# Altium project Control_Board_Model_C201.PrjPcb (part 7 of 8)

## Sheet BG95_Misc.SchDoc: BG95_Misc
size A4; DocumentNumber: 18; SheetNumber: 18; SheetTotal: 50
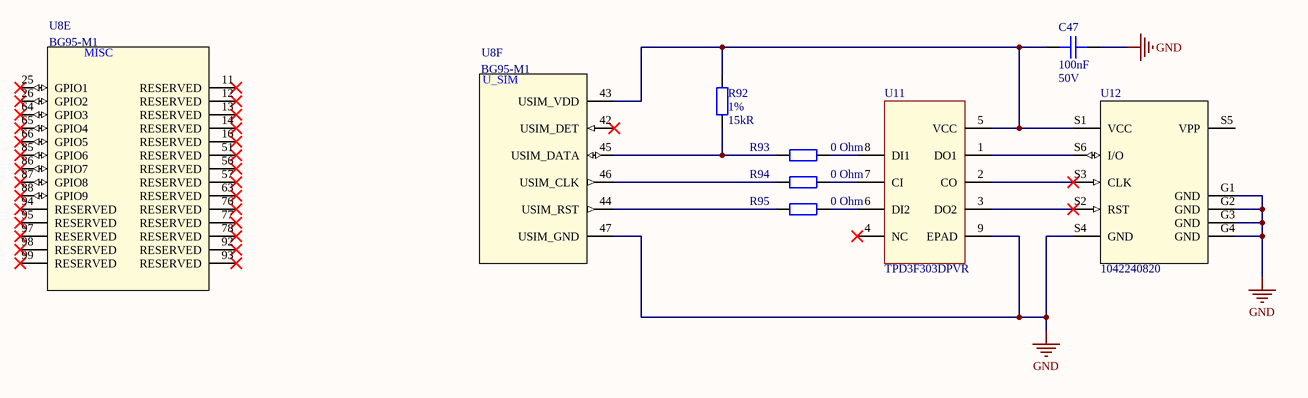
[diagram p14: BG95_Misc.SchDoc]

### Parts
C47  Capacitance: 100nF  Voltage: 50V  [C0402]  (hidden comment: CAP CER 0.1UF 50V X7R 0402)
R92  Tolerance: 1%  Resistance: 15kR  [R0402]  (hidden comment: RES SMD 15K OHM 1% 1/16W 0402)
R93  Resistance: 0 Ohm  [R0402]  (hidden comment: RES SMD 0 OHM JUMPER 1/16W 0402)
R94  Resistance: 0 Ohm  [R0402]  (hidden comment: RES SMD 0 OHM JUMPER 1/16W 0402)
R95  Resistance: 0 Ohm  [R0402]  (hidden comment: RES SMD 0 OHM JUMPER 1/16W 0402)
U8  BG95-M1  [BG95]  (parts E,F of 6)
U11  TPD3F303DPVR  [DPV8_1P7X0P4]
U12  1042240820  [1042240820_MOL]

### Nets
GND: C47.2 U8.47(USIM_GND) U11.9(EPAD) U12.G1(GND) U12.G2(GND) U12.G3(GND) U12.G4(GND) U12.S4(GND)
NetC47_1: C47.1 R92.2 U8.43(USIM_VDD) U11.5(VCC) U12.S1(VCC)
NetR92_1: R92.1 R93.1 U8.45(USIM_DATA)
NetR93_2: R93.2 U11.8(DI1)
NetR94_1: R94.1 U8.46(USIM_CLK)
NetR94_2: R94.2 U11.7(CI)
NetR95_1: R95.1 U8.44(USIM_RST)
NetR95_2: R95.2 U11.6(DI2)
NetU11_1: U11.1(DO1) U12.S6(I/O)
NetU11_2: U11.2(CO) U12.S3(CLK)
NetU11_3: U11.3(DO2) U12.S2(RST)

Not connected (* = marked no-connect by the designer): U8 11(RESERVED)* 12(RESERVED)* 13(RESERVED)* 14(RESERVED)* 16(RESERVED)* 25(GPIO1)* 26(GPIO2)* 42(USIM_DET)* 51(RESERVED)* 56(RESERVED)* 57(RESERVED)* 63(RESERVED)* 64(GPIO3)* 65(GPIO4)* 66(GPIO5)* 76(RESERVED)* 77(RESERVED)* 78(RESERVED)* 85(GPIO6)* 86(GPIO7)* 87(GPIO8)* 88(GPIO9)* 92(RESERVED)* 93(RESERVED)* 94(RESERVED)* 95(RESERVED)* 97(RESERVED)* 98(RESERVED)* 99(RESERVED)*; U11 4(NC)*; U12 S5(VPP)

### Notes on the sheet
- Title
- Size:
- Date:
- A4
- Number:
- Time:
- Revision:
- Sheet
- of
- File:
- (in symbol MOD BG95 RX TXRX CELLULAR LTE/NAV SMD, part E) MISC
- (in symbol MOD BG95 RX TXRX CELLULAR LTE/NAV SMD, part F) U_SIM

### Library data of the parts
C47 = CAP CER 0.1UF 50V X7R 0402: as C30 on sheet User_Interface; Supplier 1: Digi-Key; Stock 1: 2925303; Pricing 1: 1=0.17, 10=0.118, 50=0.0668, 100=0.0553, 500=0.0388, 1000=0.0321, 2500=0.0299, 5000=0.0273 (USD); Mount: Surface Mount; Case/Package: 0402; Weight: 2.3E-05oz; Case Code (Metric): 1005; Case Code (Imperial): 0402; Min Operating Temperature: -55°C; Max Operating Temperature: 125°C; Voltage Rating: 50V; Tolerance: 10%; Packaging: Tape and Reel; Package Quantity: 1; Voltage Rating (DC): 50V; Dielectric: X7R; Termination: SMD/SMT; Composition: Ceramic; Length: 1mm; Height: 0.5mm; Width: 0.02inch; Thickness: 0.022inch; Depth: 0.5mm; Ratings: AEC-Q200; REACH SVHC: No SVHC; Lead Free: Lead Free; ComponentLink1URL: http://product.tdk.com/capacitor/mlcc/en/documents/mlccspec_automotive_general_midvoltage_en.pdf?src-supplier=Future+Electronics; ComponentLink1Description: http://product.tdk.com/capacitor/mlcc/en/documents/mlccspec_automotive_general_midvoltage_en.pdf?src-supplier=Future+Electronics; ComponentLink2URL: http://www.farnell.com/datasheets/1807242.pdf?src-supplier=Element14; ComponentLink2Description: http://www.farnell.com/datasheets/1807242.pdf?src-supplier=Element14; ComponentLink3URL: http://www.mouser.com/ds/2/400/lcc_automotive_general_en-843974.pdf?src-supplier=Mouser; ComponentLink3Description: http://www.mouser.com/ds/2/400/lcc_automotive_general_en-843974.pdf?src-supplier=Mouser; ComponentLink4URL: http://www.farnell.com/datasheets/1936565.pdf?src-supplier=Element14; ComponentLink4Description: http://www.farnell.com/datasheets/1936565.pdf?src-supplier=Element14; ComponentLink5URL: http://www.farnell.com/datasheets/1735392.pdf?src-supplier=Element14; ComponentLink5Description: http://www.farnell.com/datasheets/1735392.pdf?src-supplier=Element14; Supplier Part Number 1: 445-6899-1-ND; ClassName: P109
R92 = RES SMD 15K OHM 1% 1/16W 0402: 15 kOhms ±1% 0.063W, 1/16W Chip Resistor 0402 (1005 Metric)  Thick Film; Manufacturer: Yageo; Manufacturer Part Number: RC0402FR-0715KL; Power Rating: 62.5mW; Voltage Rating: 50V; Temperature Coefficient: 100ppm/°C; Max Power Dissipation: 63mW; Supplier 1: Digi-Key; Stock 1: 5005874; Pricing 1: 1=0.1, 10=0.014, 100=0.0058, 1000=0.0026, 2500=0.0023, 5000=0.0019 (USD); Case/Package: 0402; Number of Pins: 2; Weight: 2.3E-05oz; Case Code (Imperial): 0402; Case Code (Metric): 1005; Min Operating Temperature: -55°C; Max Operating Temperature: 155°C; Packaging: Tape and Reel; Package Quantity: 1; Termination: SMD/SMT; Resistor Type: Thick Film; Number of Terminations: 2; Features: Moisture Resistant; Voltage Rating (DC): 50V; Length: 1mm; Height: 0.016inch; Width: 0.5mm; Depth: 0.5mm; REACH SVHC: No SVHC; Military Standard: Not; Lead Free: Lead Free; ComponentLink1URL: http://www.farnell.com/datasheets/2167052.pdf?src-supplier=Element14; ComponentLink1Description: http://www.farnell.com/datasheets/2167052.pdf?src-supplier=Element14; ComponentLink2URL: http://www.mouser.com/ds/2/447/PYu-RC0402_51_RoHS_L_6_r-8721.pdf?src-supplier=Mouser; ComponentLink2Description: http://www.mouser.com/ds/2/447/PYu-RC0402_51_RoHS_L_6_r-8721.pdf?src-supplier=Mouser; ComponentLink3URL: http://www.yageo.com/documents/recent/PYu-RC_Group_51_RoHS_L_10.pdf?src-supplier=Digi-Key; ComponentLink3Description: http://www.yageo.com/documents/recent/PYu-RC_Group_51_RoHS_L_10.pdf?src-supplier=Digi-Key; ComponentLink4URL: http://www.yageo.com/documents/recent/PYu-RC0402_51_RoHS_L_6_r.pdf?src-supplier=Future+Electronics; ComponentLink4Description: http://www.yageo.com/documents/recent/PYu-RC0402_51_RoHS_L_6_r.pdf?src-supplier=Future+Electronics; Supplier Part Number 1: 311-15.0KLRCT-ND; ClassName: P109; Mount: Surface Mount
R93-R95 = RES SMD 0 OHM JUMPER 1/16W 0402: 0 Ohms Jumper 0.063W, 1/16W Chip Resistor 0402 (1005 Metric) Moisture Resistant Thick Film; Manufacturer: Yageo; Manufacturer Part Number: RC0402JR-070RL; Power Rating: 62.5mW; Voltage Rating: 50V; Max Power Dissipation: 63mW; Temperature Coefficient: 200ppm/°C; Tolerance: 5%; Supplier 1: Digi-Key; Stock 1: 46057148; Pricing 1: 1=0.1, 10=0.013, 25=0.0092, 50=0.0072, 100=0.0053, 250=0.004, 500=0.0032, 1000=0.0024, 5000=0.0017 (USD); Contact Plating: Tin,Matte; Case Code (Metric): 1005; Case Code (Imperial): 0402; Min Operating Temperature: -55°C; Max Operating Temperature: 155°C; Packaging: Tape and Reel; Composition: Thick Film; Package Quantity: 1; Number of Terminations: 2; Termination: SMD/SMT; Military Standard: Not; Features: Moisture Resistant; Length: 1mm; Height: 0.016inch; Width: 0.02inch; Depth: 0.5mm; Radiation Hardening: No; REACH SVHC: Unknown; Lead Free: Lead Free; ComponentLink1URL: http://www.yageo.com/documents/recent/PYu-RC_Group_51_RoHS_L_10.pdf?src-supplier=Digi-Key; ComponentLink1Description: http://www.yageo.com/documents/recent/PYu-RC_Group_51_RoHS_L_10.pdf?src-supplier=Digi-Key; ComponentLink2URL: http://www.yageo.com/documents/recent/PYu-RC0402_51_RoHS_L_6.pdf?src-supplier=Avnet+Europe; ComponentLink2Description: http://www.yageo.com/documents/recent/PYu-RC0402_51_RoHS_L_6.pdf?src-supplier=Avnet+Europe; ComponentLink3URL: http://www.farnell.com/datasheets/1018594.pdf?src-supplier=Element14; ComponentLink3Description: http://www.farnell.com/datasheets/1018594.pdf?src-supplier=Element14; ComponentLink4URL: https://www.verical.com/server-webapp/html/getDatasheet?partID=326379&src-supplier=Verical; ComponentLink4Description: https://www.verical.com/server-webapp/html/getDatasheet?partID=326379&src-supplier=Verical; ComponentLink5URL: http://www.farnell.com/datasheets/2167052.pdf?src-supplier=Element14; ComponentLink5Description: http://www.farnell.com/datasheets/2167052.pdf?src-supplier=Element14; Supplier Part Number 1: 311-0.0JRCT-ND; Case/Package: 0402; ClassName: P109; Mount: Surface Mount
U8 = MOD BG95 RX TXRX CELLULAR LTE/NAV SMD: as U8 on sheet BG95_Broadband_Modem; Manufacturer Part Number: BG95-M1; PCB DECAL: BG95; Mount: Surface Mount
U11 = FILTER RC(PI) ESD SMD  8-UFDFN EP: RC (Pi) EMI Filter 2nd Order Low Pass 3 Channel R = 47Ohms, 100Ohms, C = 20pF  8-UFDFN Exposed Pad; Manufacturer: Texas Instruments; Number of Channels: 3; Operating Supply Voltage: 5.5V; Clamping Voltage: 10V; ESD Protection: Yes; Frequency: 308MHz; Supplier 1: Digi-Key; Manufacturer Part Number: TPD3F303DPVR; Stock 1: 4896; Pricing 1: 1=0.85, 10=0.812, 25=0.7856, 50=0.6414, 100=0.576, 250=0.5236, 500=0.4974, 1000=0.4451 (USD); Number of Pins: 8; Min Operating Temperature: -40°C; Max Operating Temperature: 85°C; Package Quantity: 1; Packaging: Tape and Reel; Termination: Flat; REACH SVHC: No SVHC; Lead Free: Lead Free; ComponentLink1URL: http://www.ti.com/lit/ds/symlink/tpd3f303.pdf?src-supplier=Digi-Key; ComponentLink1Description: http://www.ti.com/lit/ds/symlink/tpd3f303.pdf?src-supplier=Digi-Key; ComponentLink2URL: http://focus.ti.com/lit/ds/symlink/tpd3f303.pdf?src-supplier=Avnet+Europe; ComponentLink2Description: http://focus.ti.com/lit/ds/symlink/tpd3f303.pdf?src-supplier=Avnet+Europe; ComponentLink3URL: https://www.verical.com/server-webapp/html/getDatasheet?partID=302817&src-supplier=Verical; ComponentLink3Description: https://www.verical.com/server-webapp/html/getDatasheet?partID=302817&src-supplier=Verical; ComponentLink4URL: http://www.farnell.com/datasheets/1558442.pdf?src-supplier=Element14; ComponentLink4Description: http://www.farnell.com/datasheets/1558442.pdf?src-supplier=Element14; Supplier Part Number 1: 296-28299-1-ND; Case/Package: SMD/SMT; Contact Plating: Gold; Capacitance: 20pF; Length: 2.2mm; Height: 0.026inch; Width: 0.063inch; Depth: 1.7mm; Radiation Hardening: No; ClassName: P109; Mount: Surface Mount
U12 = NANOSIM SOCKET 1.11H P/PULL TYPE: 6 Position Card Connector NANO SIM Surface Mount, Right Angle Gold; Manufacturer: Molex; Number of Positions: 6; Pitch: 2.54mm; Supplier 1: Digi-Key; Manufacturer Part Number: 1042240820; Stock 1: 10989; Pricing 1: 1=1.31, 10=1.152, 25=1.0844, 50=1.039, 100=0.9939, 250=0.9036, 500=0.8132, 1000=0.7228 (USD); Mount: Surface Mount; Contact Plating: Gold; Number of Rows: 2; Orientation: Right Angle; Connector Type: Connector; Packaging: Tape and Reel; ComponentLink1URL: https://www.molex.com/pdm_docs/sd/1042240820_sd.pdf?src-supplier=Digi-Key; ComponentLink1Description: https://www.molex.com/pdm_docs/sd/1042240820_sd.pdf?src-supplier=Digi-Key; ComponentLink2URL: http://www.molex.com/pdm_docs/sd/1042240820_sd.pdf?src-supplier=Avnet; ComponentLink2Description: http://www.molex.com/pdm_docs/sd/1042240820_sd.pdf?src-supplier=Avnet; Supplier Part Number 1: WM23749CT-ND; ClassName: P109

## Sheet BG95_Power.SchDoc: BG95 Power Domain
size A4; DocumentNumber: 17; SheetNumber: 17; SheetTotal: 50
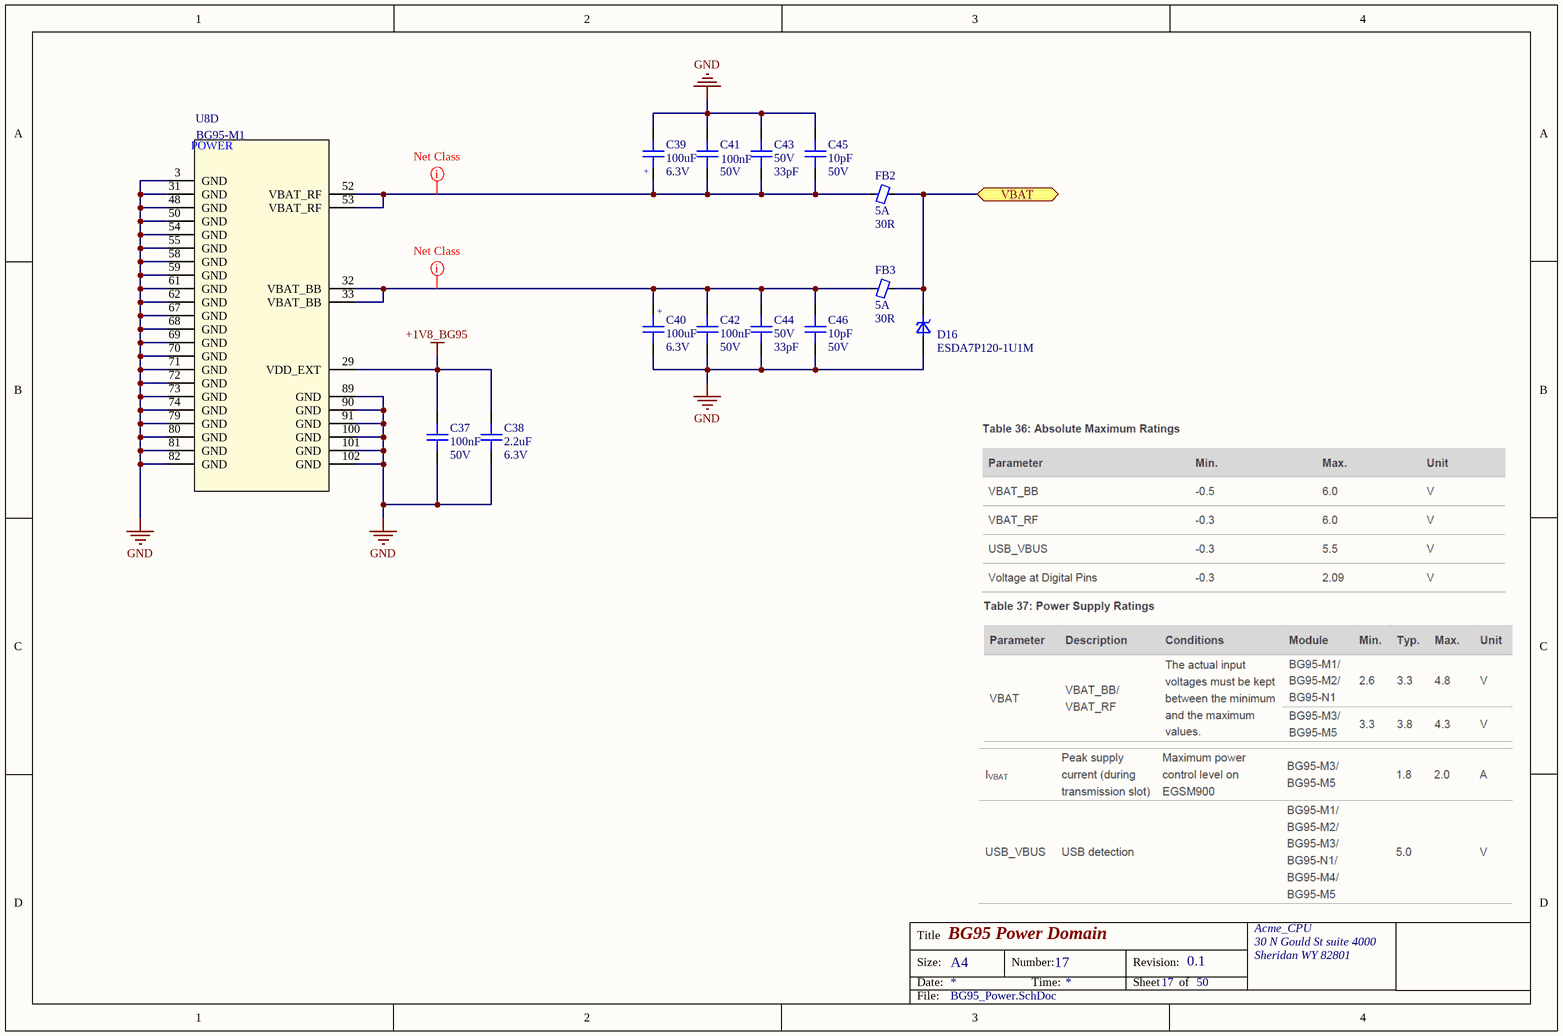
[diagram p15: BG95_Power.SchDoc]

### Parts
C37  Capacitance: 100nF  Voltage: 50V  [C0402]  (hidden comment: CAP CER 0.1UF 50V X7R 0402)
C38  Capacitance: 2.2uF  Voltage: 6.3V  [C0402]  (hidden comment: CAP CER 2.2UF 6.3V X5R 0402)
C39  Capacitance: 100uF  Voltage Rating: 6.3V  [WCAP-ASLI_5x5.5]  (hidden comment: CAP ALUM 100 UF 20% 6.3 V SMD)
C40  Capacitance: 100uF  Voltage Rating: 6.3V  [WCAP-ASLI_5x5.5]  (hidden comment: CAP ALUM 100 UF 20% 6.3 V SMD)
C41  Capacitance: 100nF  Voltage: 50V  [C0402]  (hidden comment: CAP CER 0.1UF 50V X7R 0402)
C42  Capacitance: 100nF  Voltage: 50V  [C0402]  (hidden comment: CAP CER 0.1UF 50V X7R 0402)
C43  Voltage Rating: 50V  Capacitance: 33pF  [C0402]  (hidden comment: CAP CER 33PF 50V C0G/NPO 0402)
C44  Voltage Rating: 50V  Capacitance: 33pF  [C0402]  (hidden comment: CAP CER 33PF 50V C0G/NPO 0402)
C45  Capacitance: 10pF  Voltage Rating: 50V  [C0402]  (hidden comment: CAP CER 10PF 50V C0G/NP0 0402)
C46  Capacitance: 10pF  Voltage Rating: 50V  [C0402]  (hidden comment: CAP CER 10PF 50V C0G/NP0 0402)
D16  ESDA7P120-1U1M  [ST_QFN_1610]
FB2  Current Rating: 5A  Impedance: 30R  [L0603]  (hidden comment: MPZ1608S300ATAH0)
FB3  Current Rating: 5A  Impedance: 30R  [L0603]  (hidden comment: MPZ1608S300ATAH0)
U8  BG95-M1  [BG95]  (part D of 6)

### Ports
VBAT

### Nets
+1V8_BG95: C37.2 C38.2 U8.29(VDD_EXT)
GND: C37.1 C38.1 C39.2 C40.2 C41.2 C42.1 C43.2 C44.1 C45.2 C46.1 D16.2(A) U8.3(GND) U8.31(GND) U8.48(GND) U8.50(GND) U8.54(GND) U8.55(GND) U8.58(GND) U8.59(GND) U8.61(GND) U8.62(GND) U8.67(GND) U8.68(GND) U8.69(GND) U8.70(GND) U8.71(GND) U8.72(GND) U8.73(GND) U8.74(GND) U8.79(GND) U8.80(GND) U8.81(GND) U8.82(GND) U8.89(GND) U8.90(GND) U8.91(GND) U8.100(GND) U8.101(GND) U8.102(GND)
NetC39_1: C39.1 C41.1 C43.1 C45.1 FB2.1 U8.52(VBAT_RF) U8.53(VBAT_RF)
NetC40_1: C40.1 C42.2 C44.2 C46.2 FB3.1 U8.32(VBAT_BB) U8.33(VBAT_BB)
NetD16_1: D16.1(K) FB2.2 FB3.2 ; port VBAT

### Layout directives
net class BG95_PWR: NetC39_1, NetC40_1

### Notes on the sheet
- Title
- Size:
- Date:
- A4
- Number:
- Time:
- Revision:
- Sheet
- of
- File:
- (in symbol CAP ALUM 100 UF 20% 6.3 V SMD) +
- (in symbol MOD BG95 RX TXRX CELLULAR LTE/NAV SMD, part D) POWER

### Library data of the parts
C37 C41 C42 = CAP CER 0.1UF 50V X7R 0402: as C30 on sheet User_Interface; Supplier 1: Digi-Key; Stock 1: 2925303; Pricing 1: 1=0.17, 10=0.118, 50=0.0668, 100=0.0553, 500=0.0388, 1000=0.0321, 2500=0.0299, 5000=0.0273 (USD); Mount: Surface Mount; Case/Package: 0402; Weight: 2.3E-05oz; Case Code (Metric): 1005; Case Code (Imperial): 0402; Min Operating Temperature: -55°C; Max Operating Temperature: 125°C; Voltage Rating: 50V; Tolerance: 10%; Packaging: Tape and Reel; Package Quantity: 1; Voltage Rating (DC): 50V; Dielectric: X7R; Termination: SMD/SMT; Composition: Ceramic; Length: 1mm; Height: 0.5mm; Width: 0.02inch; Thickness: 0.022inch; Depth: 0.5mm; Ratings: AEC-Q200; REACH SVHC: No SVHC; Lead Free: Lead Free; ComponentLink1URL: http://product.tdk.com/capacitor/mlcc/en/documents/mlccspec_automotive_general_midvoltage_en.pdf?src-supplier=Future+Electronics; ComponentLink1Description: http://product.tdk.com/capacitor/mlcc/en/documents/mlccspec_automotive_general_midvoltage_en.pdf?src-supplier=Future+Electronics; ComponentLink2URL: http://www.farnell.com/datasheets/1807242.pdf?src-supplier=Element14; ComponentLink2Description: http://www.farnell.com/datasheets/1807242.pdf?src-supplier=Element14; ComponentLink3URL: http://www.mouser.com/ds/2/400/lcc_automotive_general_en-843974.pdf?src-supplier=Mouser; ComponentLink3Description: http://www.mouser.com/ds/2/400/lcc_automotive_general_en-843974.pdf?src-supplier=Mouser; ComponentLink4URL: http://www.farnell.com/datasheets/1936565.pdf?src-supplier=Element14; ComponentLink4Description: http://www.farnell.com/datasheets/1936565.pdf?src-supplier=Element14; ComponentLink5URL: http://www.farnell.com/datasheets/1735392.pdf?src-supplier=Element14; ComponentLink5Description: http://www.farnell.com/datasheets/1735392.pdf?src-supplier=Element14; Supplier Part Number 1: 445-6899-1-ND; ClassName: P109
C38 = CAP CER 2.2UF 6.3V X5R 0402: 2.2µF ±20% 6.3V Ceramic Capacitor X5R 0402 (1005 Metric); Manufacturer: Murata; Manufacturer Part Number: GRM155R60J225ME15D; Supplier 1: Digi-Key; Stock 1: 4444410; Pricing 1: 1=0.29, 10=0.199, 100=0.1009, 500=0.0691, 1000=0.0611, 2500=0.0584, 5000=0.0531 (USD); Mount: Surface Mount; Case/Package: 0402; Case Code (Metric): 1005; Case Code (Imperial): 0402; Min Operating Temperature: -55°C; Max Operating Temperature: 85°C; Voltage Rating: 6.3V; Tolerance: 20%; Packaging: Tape and Reel; Package Quantity: 10000; Voltage Rating (DC): 6.3V; Dielectric: X5R; Termination: SMD/SMT; Length: 1mm; Height: 0.5mm; Width: 0.02inch; Thickness: 0.022inch; Depth: 0.5mm; REACH SVHC: No SVHC; Lead Free: Lead Free; ComponentLink1URL: https://www.murata.com/~/media/webrenewal/support/library/catalog/products/capacitor/mlcc/c02e.ashx?la=en-us&src-supplier=Digi-Key; ComponentLink1Description: https://www.murata.com/~/media/webrenewal/support/library/catalog/products/capacitor/mlcc/c02e.ashx?la=en-us&src-supplier=Digi-Key; ComponentLink2URL: http://www.murata.com/~/media/webrenewal/support/library/catalog/products/capacitor/mlcc/c02e.ashx?src-supplier=Avnet; ComponentLink2Description: http://www.murata.com/~/media/webrenewal/support/library/catalog/products/capacitor/mlcc/c02e.ashx?src-supplier=Avnet; ComponentLink3URL: http://www.farnell.com/datasheets/2047859.pdf?src-supplier=Element14; ComponentLink3Description: http://www.farnell.com/datasheets/2047859.pdf?src-supplier=Element14; ComponentLink4URL: https://produktinfo.conrad.com/datenblaetter/450000-474999/450128-da-01-de-VS_KONDENS_GRM155_R60J_225ME15D.pdf?src-supplier=Conrad; ComponentLink4Description: https://produktinfo.conrad.com/datenblaetter/450000-474999/450128-da-01-de-VS_KONDENS_GRM155_R60J_225ME15D.pdf?src-supplier=Conrad; Supplier Part Number 1: 490-4519-1-ND; Material: Ceramic; Radiation Hardening: No; ClassName: P109
C39 C40 = CAP ALUM 100 UF 20% 6.3 V SMD: 100µF 6.3V Aluminum Electrolytic Capacitors Radial, Can - SMD  2000 Hrs @ 105°C; Manufacturer: Wurth Elektronik; Manufacturer Part Number: 865080142007; Ripple Current: 170mA; Life (Hours): 2000Hour; Leakage Current: 6.3uA; Dissipation Factor: 24%; Endurance: 2000h; Capacitance Tolerance: +/-20%; Technical Reference: ASEC055101M6R3DVCTBB000; Polarity: Polar; Impedance: 800mR; Supplier 1: Digi-Key; Stock 1: 2227; Pricing 1: 1=0.2, 50=0.167, 100=0.145, 250=0.129, 500=0.113 (USD); Mount: Surface Mount; Case/Package: Radial; Min Operating Temperature: -55°C; Max Operating Temperature: 105°C; Package Quantity: 1000; Packaging: Tape and Reel; Tolerance: 20%; Height - Seated (Max): 0.217inch; ComponentLink1URL: http://www.we-online.de; ComponentLink1Description: Manufacturer; Supplier Part Number 1: 732-8472-1-ND; Ripple Current (AC): 170mA; Voltage Rating (DC): 6.3V; Diameter: 5mm; Height: 5.5mm; REACH SVHC: Unknown; ComponentLink2URL: https://www.we-online.com/catalog/datasheet/865080142007.pdf; ComponentLink2Description: Datasheet; Mounting Technology: SMT; Operating Temperature: -55 to +105degC; Published Date: May 2020; ComponentLink3URL: http://www.farnell.com/datasheets/1880090.pdf?src-supplier=Farnell; ComponentLink3Description: http://www.farnell.com/datasheets/1880090.pdf?src-supplier=Farnell; ComponentLink4URL: http://www.farnell.com/datasheets/1880090.pdf?src-supplier=Newark; ComponentLink4Description: http://www.farnell.com/datasheets/1880090.pdf?src-supplier=Newark; ComponentLink5URL: http://katalog.we-online.de/pbs/datasheet/865080142007.pdf?src-supplier=Digi-Key; ComponentLink5Description: http://katalog.we-online.de/pbs/datasheet/865080142007.pdf?src-supplier=Digi-Key; ComponentLink6URL: http://www.farnell.com/datasheets/1880090.pdf?src-supplier=Element14; ComponentLink6Description: http://www.farnell.com/datasheets/1880090.pdf?src-supplier=Element14; ComponentLink7URL: https://katalog.we-online.de/pbs/datasheet/865080142007.pdf?src-supplier=Digi-Key; ComponentLink7Description: https://katalog.we-online.de/pbs/datasheet/865080142007.pdf?src-supplier=Digi-Key; ClassName: P109
C43 C44 = CAP CER 33PF 50V C0G/NPO 0402: 33pF ±5% 50V Ceramic Capacitor C0G, NP0 0402 (1005 Metric); Manufacturer: Yageo; Manufacturer Part Number: CC0402JRNPO9BN330; Insulation Resistance: 100GR; Supplier 1: Digi-Key; Stock 1: 622219; Pricing 1: 1=0.1, 10=0.022, 100=0.0099, 500=0.0071, 1000=0.0056, 2500=0.0051, 5000=0.0047 (USD); Mount: Surface Mount; Number of Pins: 2; Weight: 2.3E-05oz; Case Code (Imperial): 0402; Case Code (Metric): 1005; Dielectric Material: Ceramic; Min Operating Temperature: -55°C; Max Operating Temperature: 125°C; Tolerance: 5%; Dielectric: C0G; Voltage Rating (DC): 50V; Packaging: Tape and Reel; Package Quantity: 1; Termination: SMD/SMT; Composition: Ceramic; Length: 1mm; Height: 0.5mm; Depth: 0.5mm; Width: 0.5mm; Thickness: 0.022inch; Radiation Hardening: No; REACH SVHC: No SVHC; Lead Free: Lead Free; ComponentLink1URL: https://www.verical.com/server-webapp/html/getDatasheet?partID=403453&src-supplier=Verical; ComponentLink1Description: https://www.verical.com/server-webapp/html/getDatasheet?partID=403453&src-supplier=Verical; ComponentLink2URL: http://www.farnell.com/datasheets/2213336.pdf?src-supplier=Element14; ComponentLink2Description: http://www.farnell.com/datasheets/2213336.pdf?src-supplier=Element14; ComponentLink3URL: http://www.mouser.com/ds/2/447/Yageo_UPY-GP_NP0_16V-to-50V_9-358835.pdf?src-supplier=Mouser; ComponentLink3Description: http://www.mouser.com/ds/2/447/Yageo_UPY-GP_NP0_16V-to-50V_9-358835.pdf?src-supplier=Mouser; ComponentLink4URL: http://www.yageo.com/documents/recent/UPY-GP_NP0_16V-to-50V_16.pdf?src-supplier=Digi-Key; ComponentLink4Description: http://www.yageo.com/documents/recent/UPY-GP_NP0_16V-to-50V_16.pdf?src-supplier=Digi-Key; ComponentLink5URL: http://www.yageo.com/documents/recent/UPY-GP_NP0_16V-to-50V_8.pdf?src-supplier=Avnet+Europe; ComponentLink5Description: http://www.yageo.com/documents/recent/UPY-GP_NP0_16V-to-50V_8.pdf?src-supplier=Avnet+Europe; Supplier Part Number 1: 311-1020-1-ND; Case/Package: 0402; ClassName: P109
C45 C46 = CAP CER 10PF 50V C0G/NP0 0402: 10pF ±10% 50V Ceramic Capacitor C0G, NP0 0402 (1005 Metric); Manufacturer: KEMET; Manufacturer Part Number: C0402C100K5GACTU; Dissipation Factor: 0.1%; Supplier 1: Digi-Key; Stock 1: 57093; Pricing 1: 1=0.1, 10=0.021, 50=0.0116, 100=0.0095, 500=0.0068, 1000=0.0053, 2500=0.0048, 5000=0.0045 (USD); Mount: Surface Mount; Case/Package: 0402; Case Code (Metric): 1005; Case Code (Imperial): 0402; Dielectric Material: Ceramic; Min Operating Temperature: -55°C; Max Operating Temperature: 125°C; Tolerance: 10%; Packaging: Tape and Reel; Package Quantity: 10000; Voltage Rating (DC): 50V; Dielectric: C0G; Termination: SMD/SMT; Length: 1mm; Height: 0.5mm; Width: 0.02inch; Thickness: 0.022inch; Lead Pitch: 0.3mm; Depth: 0.5mm; Radiation Hardening: No; REACH SVHC: No SVHC; Lead Free: Lead Free; ComponentLink1URL: http://www.mouser.com/ds/2/212/KEM_C1003_C0G_SMD-1101588.pdf?src-supplier=Mouser; ComponentLink1Description: http://www.mouser.com/ds/2/212/KEM_C1003_C0G_SMD-1101588.pdf?src-supplier=Mouser; Supplier Part Number 1: 399-7747-1-ND; ClassName: P109
D16 = TVS DIODE ESDA7P120-1U1M 5.5V 11.5V 1610: 11.5V Clamp 120A (8/20µs) Ipp Tvs Diode Surface Mount 1610; Manufacturer: STMicroelectronics; Reverse Standoff Voltage: 5.5V; Number of Unidirectional Channels: 1; Min Breakdown Voltage: 6.4V; Peak Pulse Power: 1.4kW; Power Line Protection: No; Supplier 1: Digi-Key; Manufacturer Part Number: ESDA7P120-1U1M; Stock 1: 15775; Pricing 1: 1=0.35, 10=0.287, 25=0.2624, 100=0.1647, 250=0.1629, 500=0.1525, 1000=0.1037, 2500=0.0994 (USD); Packaging: Cut Tape; ComponentLink1URL: http://www.st.com/content/ccc/resource/technical/document/datasheet/group3/5e/7c/5d/76/3f/de/45/35/DM00359316/files/DM00359316.pdf/jcr:content/translations/en.DM00359316.pdf?src-supplier=Digi-Key; ComponentLink1Description: http://www.st.com/content/ccc/resource/technical/document/datasheet/group3/5e/7c/5d/76/3f/de/45/35/DM00359316/files/DM00359316.pdf/jcr:content/translations/en.DM00359316.pdf?src-supplier=Digi-Key; Supplier Part Number 1: 497-17159-1-ND; Mount: Surface Mount; Case/Package: 0603; Case Code (Imperial): 0603; Case Code (Metric): 1610; Min Operating Temperature: -55°C; Max Operating Temperature: 150°C; Composition: Zener; Clamping Voltage: 11.5V; Peak Pulse Current: 120A; ComponentLink2URL: http://www.farnell.com/datasheets/2815837.pdf?src-supplier=Newark; ComponentLink2Description: http://www.farnell.com/datasheets/2815837.pdf?src-supplier=Newark; ComponentLink3URL: http://www.farnell.com/datasheets/2815837.pdf?src-supplier=Farnell; ComponentLink3Description: http://www.farnell.com/datasheets/2815837.pdf?src-supplier=Farnell; ComponentLink4URL: http://www.farnell.com/datasheets/2815837.pdf?src-supplier=Element14; ComponentLink4Description: http://www.farnell.com/datasheets/2815837.pdf?src-supplier=Element14; ClassName: P109
FB2 FB3 = FERRITE BEAD 30 OHM 0603 1LN: 30 Ohms @ 100MHz 1 Power Line Ferrite Bead 0603 (1608 Metric) 5A 10mOhm; Manufacturer: TDK; Tolerance: 25%; DC Resistance (DCR): 10mR; Supplier 1: Digi-Key; Manufacturer Part Number: MPZ1608S300ATAH0; Stock 1: 93167; Pricing 1: 1=0.1, 10=0.079, 25=0.0716, 50=0.0644, 100=0.0472, 250=0.0343, 500=0.0315, 1000=0.0272 (USD); Case/Package: 0603; Case Code (Metric): 1608; Case Code (Imperial): 0603; Min Operating Temperature: -55°C; Max Operating Temperature: 125°C; Package Quantity: 4000; Packaging: Tape and Reel; Termination: SMD/SMT; Length: 0.063inch; Height: 0.6mm; Width: 0.031inch; Depth: 0.8mm; REACH SVHC: No SVHC; Lead Free: Lead Free; ComponentLink1URL: https://media.digikey.com/pdf/Data%20Sheets/TDK%20PDFs/MPZ_Series_Br.pdf?src-supplier=Digi-Key; ComponentLink1Description: https://media.digikey.com/pdf/Data%20Sheets/TDK%20PDFs/MPZ_Series_Br.pdf?src-supplier=Digi-Key; ComponentLink2URL: http://www.farnell.com/datasheets/1795297.pdf?src-supplier=Element14; ComponentLink2Description: http://www.farnell.com/datasheets/1795297.pdf?src-supplier=Element14; Supplier Part Number 1: 445-1562-6-ND; Max DC Current: 5A; Test Frequency: 100MHz; Revision: July-2002: Re-released for DXP Platform.; Mount: Surface Mount; Weight: 7.1E-05oz; Core Material: Ferrite; ClassName: P109
U8 = MOD BG95 RX TXRX CELLULAR LTE/NAV SMD: as U8 on sheet BG95_Broadband_Modem; Manufacturer Part Number: BG95-M1; PCB DECAL: BG95; Mount: Surface Mount

## Sheet BG95_RF.SchDoc: BG95 RF Interface
size A4; DocumentNumber: 16; SheetNumber: 16; SheetTotal: 50
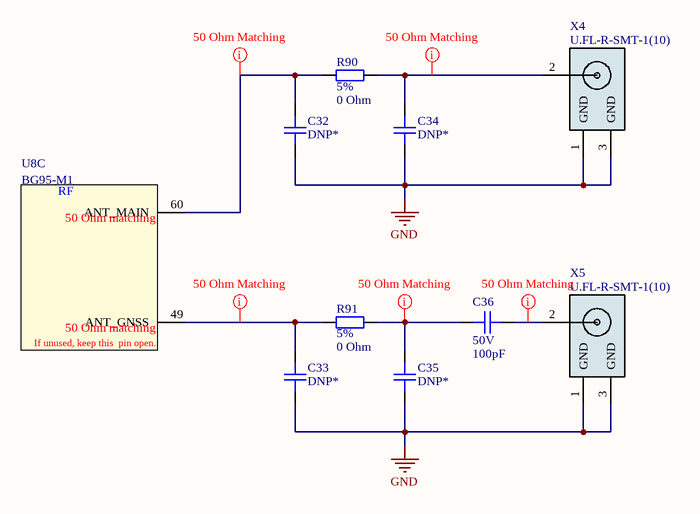
[diagram p16: BG95_RF.SchDoc]

### Parts
C32  DNP*  [C0402]  (no BOM)
C33  DNP*  [C0402]  (no BOM)
C34  DNP*  [C0402]  (no BOM)
C35  DNP*  [C0402]  (no BOM)
C36  Voltage: 50V  Capacitance: 100pF  [C0402]  (hidden comment: C 100pF 50V C0G, NP0 0402)
R90  Tolerance: 5%  Resistance: 0 Ohm  [R0402]  (hidden comment: RES SMD 0 OHM JUMPER 1/16W 0402)
R91  Tolerance: 5%  Resistance: 0 Ohm  [R0402]  (hidden comment: RES SMD 0 OHM JUMPER 1/16W 0402)
U8  BG95-M1  [BG95]  (part C of 6)
X4  U.FL-R-SMT-1(10)  [CONN U.FL RCPT STR 50 OHM SMD]
X5  U.FL-R-SMT-1(10)  [CONN U.FL RCPT STR 50 OHM SMD]

### Nets
GND: C32.1 C33.1 C34.1 C35.1 X4.1(GND) X4.3(GND) X5.1(GND) X5.3(GND)
NetC32_2: C32.2 R90.1 U8.60(ANT_MAIN)
NetC33_2: C33.2 R91.1 U8.49(ANT_GNSS)
NetC34_2: C34.2 R90.2 X4.2(Signal)
NetC35_2: C35.2 C36.1 R91.2
NetC36_2: C36.2 X5.2(Signal)

### Layout directives
rule Width Constraint [Pref Impedance = 50.00ohms    Min Impedance = 45.00ohms    Max Impedance = 55.00ohms]: NetC32_2, NetC33_2, NetC34_2, NetC35_2, NetC36_2

### Notes on the sheet
- Title
- Size:
- Date:
- A4
- Number:
- Time:
- Revision:
- Sheet
- of
- File:
- (in symbol MOD BG95 RX TXRX CELLULAR LTE/NAV SMD, part C) RF; 50 Ohm matching; If unused, keep this  pin open.

### Library data of the parts
C32-C35 = CAP CER NO_BOM 0402: Placeholder for a 0402 capacitor; ClassName: P109
C36 = C 100pF 50V C0G, NP0 0402: 100pF ±5% 50V Ceramic Capacitor C0G, NP0 0402 (1005 Metric); Manufacturer: Yageo; Manufacturer Part Number: CC0402JRNPO9BN101; Temperature Coefficient: 30ppm/°C; Insulation Resistance: 100GR; Supplier 1: Digi-Key; Stock 1: 4235236; Pricing 1: 1=0.1, 10=0.02, 100=0.0089, 500=0.0064, 1000=0.005, 2500=0.0046, 5000=0.0042 (USD); Mount: Surface Mount; Case/Package: 0402; Number of Pins: 2; Case Code (Imperial): 0402; Case Code (Metric): 1005; Dielectric Material: Ceramic; Min Operating Temperature: -55°C; Max Operating Temperature: 125°C; Tolerance: 5%; Voltage Rating (DC): 50V; Packaging: Tape and Reel; Package Quantity: 1; Termination: SMD/SMT; Composition: Ceramic; Length: 1mm; Height: 0.5mm; Width: 0.5mm; Thickness: 0.022inch; Depth: 0.5mm; Radiation Hardening: No; REACH SVHC: No SVHC; Lead Free: Lead Free; ComponentLink1URL: http://www.farnell.com/datasheets/2213336.pdf?src-supplier=Newark; ComponentLink1Description: http://www.farnell.com/datasheets/2213336.pdf?src-supplier=Newark; ComponentLink2URL: http://www.yageo.com/documents/recent/UPY-GP_NP0_16V-to-50V_16.pdf?src-supplier=Digi-Key; ComponentLink2Description: http://www.yageo.com/documents/recent/UPY-GP_NP0_16V-to-50V_16.pdf?src-supplier=Digi-Key; ComponentLink3URL: http://documents.rs-components.com/techlib://itc_doclist_GB.htm?stockno=6698684&src-supplier=RSComponents; ComponentLink3Description: http://documents.rs-components.com/techlib://itc_doclist_GB.htm?stockno=6698684&src-supplier=RSComponents; ComponentLink4URL: http://www.yageo.com/documents/recent/UPY-GP_NP0_16V-to-50V_8.pdf?src-supplier=Avnet+Europe; ComponentLink4Description: http://www.yageo.com/documents/recent/UPY-GP_NP0_16V-to-50V_8.pdf?src-supplier=Avnet+Europe; ComponentLink5URL: http://www.farnell.com/datasheets/1443161.pdf?src-supplier=Element14; ComponentLink5Description: http://www.farnell.com/datasheets/1443161.pdf?src-supplier=Element14; ComponentLink6URL: http://www.farnell.com/datasheets/2213336.pdf?src-supplier=Element14; ComponentLink6Description: http://www.farnell.com/datasheets/2213336.pdf?src-supplier=Element14; Supplier Part Number 1: 311-1024-1-ND; Dielectric: C0G; Voltage Rating: 50V
R90 R91 = RES SMD 0 OHM JUMPER 1/16W 0402: as R59 on sheet User_Interface; Supplier 1: Digi-Key; Stock 1: 46057148; Pricing 1: 1=0.1, 10=0.013, 25=0.0092, 50=0.0072, 100=0.0053, 250=0.004, 500=0.0032, 1000=0.0024, 5000=0.0017 (USD); Contact Plating: Tin,Matte; Case Code (Metric): 1005; Case Code (Imperial): 0402; Min Operating Temperature: -55°C; Max Operating Temperature: 155°C; Packaging: Tape and Reel; Composition: Thick Film; Package Quantity: 1; Number of Terminations: 2; Termination: SMD/SMT; Military Standard: Not; Features: Moisture Resistant; Length: 1mm; Height: 0.016inch; Width: 0.02inch; Depth: 0.5mm; Radiation Hardening: No; REACH SVHC: Unknown; Lead Free: Lead Free; ComponentLink1URL: http://www.yageo.com/documents/recent/PYu-RC_Group_51_RoHS_L_10.pdf?src-supplier=Digi-Key; ComponentLink1Description: http://www.yageo.com/documents/recent/PYu-RC_Group_51_RoHS_L_10.pdf?src-supplier=Digi-Key; ComponentLink2URL: http://www.yageo.com/documents/recent/PYu-RC0402_51_RoHS_L_6.pdf?src-supplier=Avnet+Europe; ComponentLink2Description: http://www.yageo.com/documents/recent/PYu-RC0402_51_RoHS_L_6.pdf?src-supplier=Avnet+Europe; ComponentLink3URL: http://www.farnell.com/datasheets/1018594.pdf?src-supplier=Element14; ComponentLink3Description: http://www.farnell.com/datasheets/1018594.pdf?src-supplier=Element14; ComponentLink4URL: https://www.verical.com/server-webapp/html/getDatasheet?partID=326379&src-supplier=Verical; ComponentLink4Description: https://www.verical.com/server-webapp/html/getDatasheet?partID=326379&src-supplier=Verical; ComponentLink5URL: http://www.farnell.com/datasheets/2167052.pdf?src-supplier=Element14; ComponentLink5Description: http://www.farnell.com/datasheets/2167052.pdf?src-supplier=Element14; Supplier Part Number 1: 311-0.0JRCT-ND; Case/Package: 0402; ClassName: P109; Mount: Surface Mount
U8 = MOD BG95 RX TXRX CELLULAR LTE/NAV SMD: as U8 on sheet BG95_Broadband_Modem; Manufacturer Part Number: BG95-M1; PCB DECAL: BG95; Mount: Surface Mount
X4 X5 = CONN U.FL RCPT STR 50 OHM SMD: U.FL (UMCC) Connector Receptacle, Male Pin 50Ohm Surface Mount Solder; Manufacturer: Hirose; Body Material: Bronze; Body Plating: Silver; Dielectric Material: Polymer; Impedance: 50R; Connector Type: Coaxial,Receptacle,Male Pin; Frequency: 6GHz; Insulation Resistance: 500MR; Wire/Cable Type: Coaxial; Supplier 1: Digi-Key; Manufacturer Part Number: U.FL-R-SMT-1(10); Stock 1: 19543; Pricing 1: 1=1.31, 10=1.15, 25=1.0824, 50=1.0374, 100=0.9922, 250=0.902, 500=0.8118, 1000=0.7216 (USD); Mount: Surface Mount; Contact Material: Brass,Bronze; Contact Plating: Gold; Housing Color: Beige; Min Operating Temperature: -40°C; Max Operating Temperature: 90°C; Termination: Solder; Orientation: Straight; Packaging: Tape and Reel; Package Quantity: 2500; Fastening Type: Snap; Max Frequency: 6GHz; Gender: Male; Length: 3mm; Depth: 3.1mm; Radiation Hardening: No; REACH SVHC: No SVHC; Lead Free: Lead Free; ComponentLink1URL: http://www.farnell.com/datasheets/91524.pdf?src-supplier=Element14; ComponentLink1Description: http://www.farnell.com/datasheets/91524.pdf?src-supplier=Element14; ComponentLink2URL: http://uk.rs-online.com/webdocs/1363/0900766b81363563.pdf?src-supplier=RSComponents; ComponentLink2Description: http://uk.rs-online.com/webdocs/1363/0900766b81363563.pdf?src-supplier=RSComponents; ComponentLink3URL: http://www.farnell.com/datasheets/2691132.pdf?src-supplier=Element14; ComponentLink3Description: http://www.farnell.com/datasheets/2691132.pdf?src-supplier=Element14; Supplier Part Number 1: H11891CT-ND; ClassName: P109

## Sheet BG95_VLT.SchDoc: BG95 Voltage Level Translator
size A4; DocumentNumber: 19; SheetNumber: 19; SheetTotal: 50
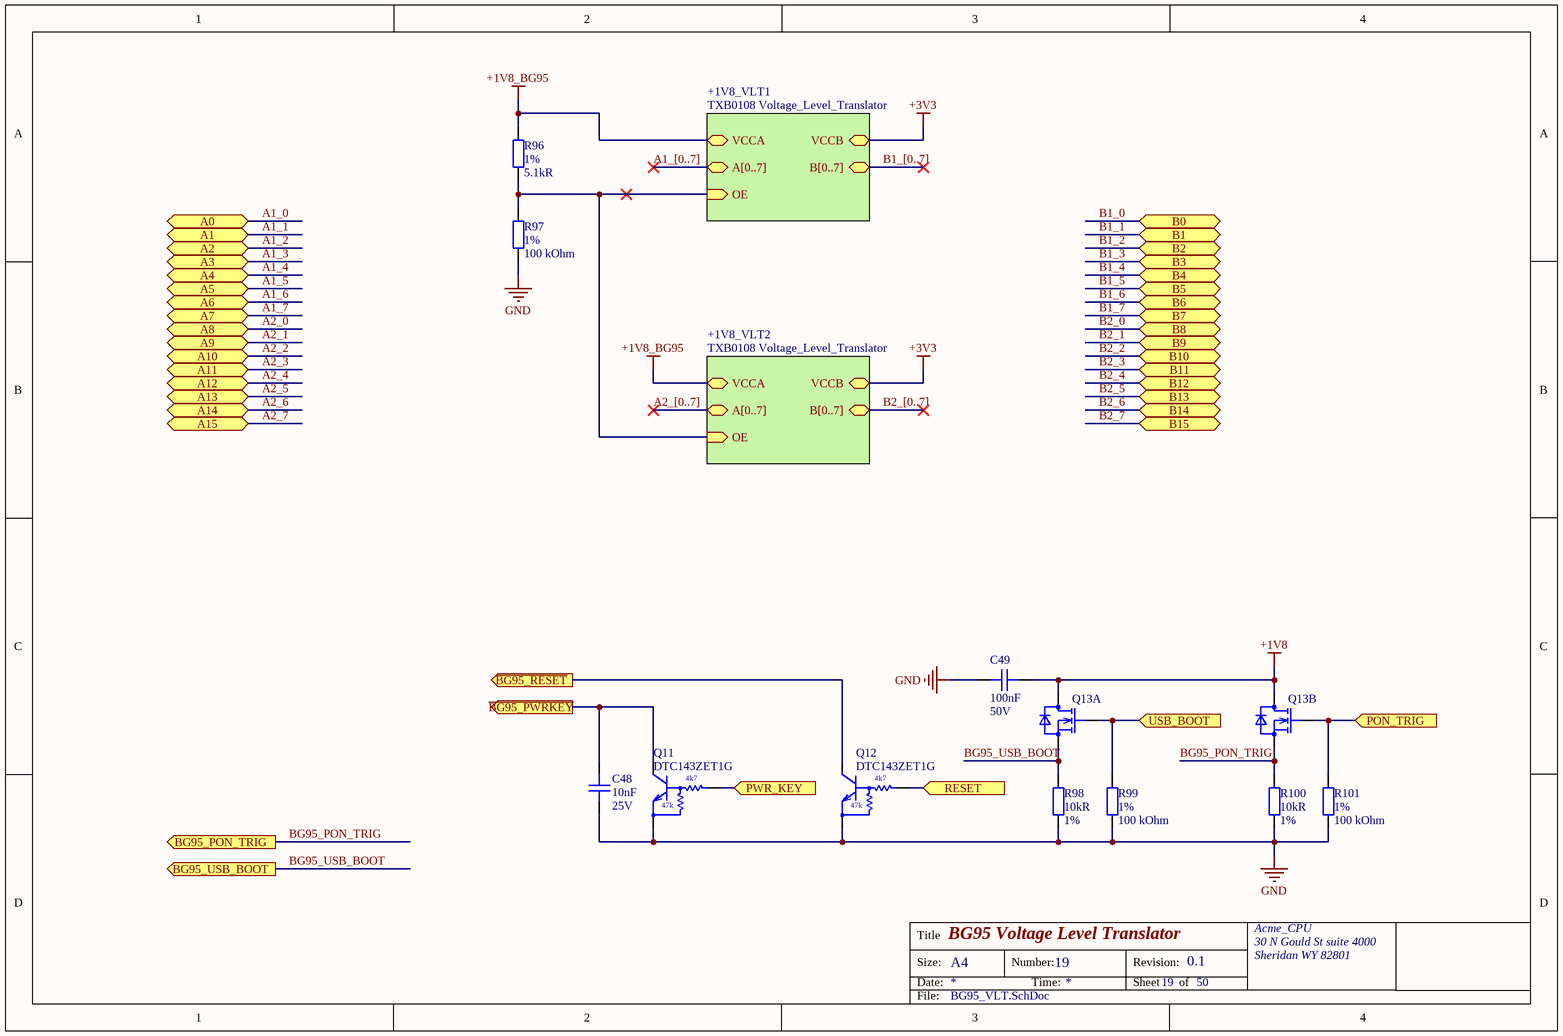
[diagram p17: BG95_VLT.SchDoc]

### Parts
C48  Capacitance: 10nF  Voltage: 25V  [C0402]  (hidden comment: CAP CER 10nF 25V X7R 10% 0402)
C49  Capacitance: 100nF  Voltage: 50V  [C0402]  (hidden comment: CAP CER 0.1UF 50V X7R 0402)
Q11  DTC143ZET1G  [SOT-416FL_ONS]
Q12  DTC143ZET1G  [SOT-416FL_ONS]
Q13  DMN32D2LV-7  [SON_400UV-7_DIO]  (value not drawn)  (parts A,B of 2)
R96  Tolerance: 1%  Resistance: 5.1kR  [R0402]  (hidden comment: RES SMD 5.1K OHM 1% 1/16W 0402)
R97  Tolerance: 1%  Resistance: 100 kOhm  [R0402]  (hidden comment: RES SMD 100K OHM 1% 1/16W 0402)
R98  Resistance: 10kR  Tolerance: 1%  [R0402]  (hidden comment: RES SMD 10K OHM 1% 1/16W 0402)
R99  Tolerance: 1%  Resistance: 100 kOhm  [R0402]  (hidden comment: RES SMD 100K OHM 1% 1/16W 0402)
R100  Resistance: 10kR  Tolerance: 1%  [R0402]  (hidden comment: RES SMD 10K OHM 1% 1/16W 0402)
R101  Tolerance: 1%  Resistance: 100 kOhm  [R0402]  (hidden comment: RES SMD 100K OHM 1% 1/16W 0402)

### Sub-sheets
+1V8_VLT1 = TXB0108 Voltage_Level_Translator (file not in this document): A[0..7], B[0..7], VCCA, VCCB, OE (in)
+1V8_VLT2 = TXB0108 Voltage_Level_Translator (file not in this document): A[0..7], B[0..7], VCCA, VCCB, OE (in)

### Ports
A0, A1, A2, A3, A4, A5, A6, A7, A8, A9, A10, A11, A12, A13, A14, A15, B0, B1, B2, B3, B4, B5, B6, B7, B8, B9, B10, B11, B12, B13, B14, B15, BG95_PON_TRIG (out), BG95_USB_BOOT (out), PON_TRIG (in), PWR_KEY (in), RESET (in), USB_BOOT (in), ~{BG95_PWRKEY} (out), ~{BG95_RESET} (out)

### Nets
+1V8: C49.2 Q13.3(D) Q13.6(D)
+1V8_BG95: R96.1 ; sheet +1V8_VLT1/VCCA, sheet +1V8_VLT2/VCCA
+3V3: sheet +1V8_VLT1/VCCB, sheet +1V8_VLT2/VCCB
GND: C48.1 C49.1 Q11.2(E) Q12.2(E) R97.1 R98.2 R99.1 R100.2 R101.1
~{BG95_PWRKEY}: C48.2 Q11.3(C) ; port ~{BG95_PWRKEY}
~{BG95_RESET}: Q12.3(C) ; port ~{BG95_RESET}
B1_0: port B0
B1_1: port B1
B1_2: port B2
B1_3: port B3
B1_4: port B4
B1_5: port B5
B1_6: port B6
B1_7: port B7
B2_0: port B8
B2_1: port B9
B2_2: port B10
B2_3: port B11
B2_4: port B12
B2_5: port B13
B2_6: port B14
B2_7: port B15
BG95_PON_TRIG: Q13.4(S) R100.1 ; port BG95_PON_TRIG
BG95_USB_BOOT: Q13.1(S) R98.1 ; port BG95_USB_BOOT
DIO_2_8: Q12.1(B) ; port RESET
DIO_2_9: Q11.1(B) ; port PWR_KEY
DIO_2_10: Q13.5(G) R101.2 ; port PON_TRIG
DIO_2_11: Q13.2(G) R99.2 ; port USB_BOOT
NetR96_2: R96.2 R97.2 ; sheet +1V8_VLT1/OE, sheet +1V8_VLT2/OE

### Buses and harness runs
bus A1_[0..7] = sheet +1V8_VLT1/A[0..7]
bus A2_[0..7] = sheet +1V8_VLT2/A[0..7]
bus B1_[0..7] = sheet +1V8_VLT1/B[0..7]
bus B2_[0..7] = sheet +1V8_VLT2/B[0..7]

### Notes on the sheet
- Title
- Size:
- Date:
- A4
- Number:
- Time:
- Revision:
- Sheet
- of
- File:
- (in symbol TRANS PREBIAS NPN 200MW SC75) 4k7; 47k

### Library data of the parts
C48 = CAP CER 10nF 25V X7R 10% 0402: Manufacturer: Kyocera AVX; Manufacturer Part Number: 04023C103KAT2A; Dissipation Factor: 12.5%; Insulation Resistance: 100GR; Supplier 1: Digi-Key; Stock 1: 1015537; Pricing 1: 1=0.1, 10=0.034, 50=0.0182, 100=0.0149, 500=0.0107, 1000=0.0084, 2500=0.0076, 5000=0.007 (USD); Mount: Surface Mount; Case/Package: 0402; Case Code (Metric): 1005; Case Code (Imperial): 0402; Min Operating Temperature: -55°C; Max Operating Temperature: 125°C; Tolerance: 10%; Dielectric: X7R; Voltage Rating (DC): 25V; Packaging: Tape and Reel; Voltage Rating: 25V; Package Quantity: 1; Termination: SMD/SMT; Length: 1mm; Height: 0.56mm; Depth: 0.5mm; Width: 0.02inch; Thickness: 0.022inch; Radiation Hardening: No; REACH SVHC: No SVHC; Lead Free: Lead Free; ComponentLink1URL: http://www.farnell.com/datasheets/2237835.pdf?src-supplier=Element14; ComponentLink1Description: http://www.farnell.com/datasheets/2237835.pdf?src-supplier=Element14; ComponentLink2URL: http://catalogs.avx.com/SurfaceMount.pdf?src-supplier=Digi-Key; ComponentLink2Description: http://catalogs.avx.com/SurfaceMount.pdf?src-supplier=Digi-Key; ComponentLink3URL: http://www.alliedelec.com/m/d/a24bb5190bea413b2ff164816f55e87c.pdf?src-supplier=Allied+Electronics; ComponentLink3Description: http://www.alliedelec.com/m/d/a24bb5190bea413b2ff164816f55e87c.pdf?src-supplier=Allied+Electronics; ComponentLink4URL: http://uk.rs-online.com/webdocs/13ec/0900766b813ece35.pdf?src-supplier=RSComponents; ComponentLink4Description: http://uk.rs-online.com/webdocs/13ec/0900766b813ece35.pdf?src-supplier=RSComponents; Supplier Part Number 1: 478-1113-1-ND; ClassName: P109
C49 = CAP CER 0.1UF 50V X7R 0402: as C30 on sheet User_Interface; Supplier 1: Digi-Key; Stock 1: 2925303; Pricing 1: 1=0.17, 10=0.118, 50=0.0668, 100=0.0553, 500=0.0388, 1000=0.0321, 2500=0.0299, 5000=0.0273 (USD); Mount: Surface Mount; Case/Package: 0402; Weight: 2.3E-05oz; Case Code (Metric): 1005; Case Code (Imperial): 0402; Min Operating Temperature: -55°C; Max Operating Temperature: 125°C; Voltage Rating: 50V; Tolerance: 10%; Packaging: Tape and Reel; Package Quantity: 1; Voltage Rating (DC): 50V; Dielectric: X7R; Termination: SMD/SMT; Composition: Ceramic; Length: 1mm; Height: 0.5mm; Width: 0.02inch; Thickness: 0.022inch; Depth: 0.5mm; Ratings: AEC-Q200; REACH SVHC: No SVHC; Lead Free: Lead Free; ComponentLink1URL: http://product.tdk.com/capacitor/mlcc/en/documents/mlccspec_automotive_general_midvoltage_en.pdf?src-supplier=Future+Electronics; ComponentLink1Description: http://product.tdk.com/capacitor/mlcc/en/documents/mlccspec_automotive_general_midvoltage_en.pdf?src-supplier=Future+Electronics; ComponentLink2URL: http://www.farnell.com/datasheets/1807242.pdf?src-supplier=Element14; ComponentLink2Description: http://www.farnell.com/datasheets/1807242.pdf?src-supplier=Element14; ComponentLink3URL: http://www.mouser.com/ds/2/400/lcc_automotive_general_en-843974.pdf?src-supplier=Mouser; ComponentLink3Description: http://www.mouser.com/ds/2/400/lcc_automotive_general_en-843974.pdf?src-supplier=Mouser; ComponentLink4URL: http://www.farnell.com/datasheets/1936565.pdf?src-supplier=Element14; ComponentLink4Description: http://www.farnell.com/datasheets/1936565.pdf?src-supplier=Element14; ComponentLink5URL: http://www.farnell.com/datasheets/1735392.pdf?src-supplier=Element14; ComponentLink5Description: http://www.farnell.com/datasheets/1735392.pdf?src-supplier=Element14; Supplier Part Number 1: 445-6899-1-ND
Q11 Q12 = TRANS PREBIAS NPN 200MW SC75: as Q7 on sheet BG95_Broadband_Modem; Supplier 1: Digi-Key; Manufacturer Part Number: DTC143ZET1G; Stock 1: 44167; Pricing 1: 1=0.14, 10=0.129, 25=0.1224, 100=0.0539, 500=0.0423, 1000=0.0294 (USD); Number of Pins: 3; Min Operating Temperature: -55°C; Max Operating Temperature: 150°C; Package Quantity: 1; Packaging: Tape and Reel; Max Power Dissipation: 200mW; Power Dissipation: 200mW; Voltage Rating (DC): 50V; Current Rating: 100mA; Length: 1.65mm; Height: 0.8mm; Width: 0.9mm; Radiation Hardening: No; REACH SVHC: No SVHC; Lead Free: Lead Free; ComponentLink1URL: http://www.onsemi.com/pub/Collateral/DTC143Z-D.PDF?src-supplier=Digi-Key; ComponentLink1Description: http://www.onsemi.com/pub/Collateral/DTC143Z-D.PDF?src-supplier=Digi-Key; ComponentLink2URL: http://www.onsemi.com/pub_link/Collateral/DTC124E-D.PDF?src-supplier=Avnet+Europe; ComponentLink2Description: http://www.onsemi.com/pub_link/Collateral/DTC124E-D.PDF?src-supplier=Avnet+Europe; ComponentLink3URL: https://www.verical.com/server-webapp/html/getDatasheet?partID=60141&src-supplier=Verical; ComponentLink3Description: https://www.verical.com/server-webapp/html/getDatasheet?partID=60141&src-supplier=Verical; Supplier Part Number 1: DTC143ZET1GOSCT-ND; Case/Package: SC; Contact Plating: Tin,Matte; Collector Emitter Voltage (VCEO): 50V; Max Collector Current: 100mA; Collector Emitter Breakdown Voltage: 50V; Max Output Current: 100mA; Operating Supply Voltage: 50V; Max Breakdown Voltage: 50V; Polarity: NPN; Continuous Collector Current: 100mA; Halogen Free: Halogen Free; ClassName: P109; Mount: Surface Mount
Q13 = ARRAY MOSFET 2N-CH 30V 0.4A SOT-563: Mosfet Array 2 N-Channel (Dual) 30V 400mA 400mW Surface Mount SOT-563; Manufacturer: Diodes; Gate to Source Voltage (Vgs): 10V; Rds On Max: 1.2R; Input Capacitance: 39pF; Number of Channels: 2; Supplier 1: Digi-Key; Manufacturer Part Number: DMN32D2LV-7; Stock 1: 141366; Pricing 1: 1=0.39, 10=0.338, 25=0.3152, 100=0.234, 500=0.1827, 1000=0.1485 (USD); Mount: Surface Mount; Min Operating Temperature: -55°C; Max Operating Temperature: 150°C; Continuous Drain Current (ID): 400mA; Package Quantity: 3000; Packaging: Tape and Reel; Drain to Source Voltage (Vdss): 30V; Max Power Dissipation: 400mW; Drain to Source Breakdown Voltage: 30V; Drain to Source Resistance: 1.2R; Element Configuration: Dual; FET Type: 2 N-Channel; Length: 1.6mm; Height: 0.6mm; Width: 1.2mm; Radiation Hardening: No; REACH SVHC: No SVHC; ComponentLink1URL: https://www.diodes.com/assets/Datasheets/ds31121.pdf?src-supplier=Digi-Key; ComponentLink1Description: https://www.diodes.com/assets/Datasheets/ds31121.pdf?src-supplier=Digi-Key; ComponentLink2URL: http://www.mouser.com/ds/2/115/ds31121-89496.pdf?src-supplier=Mouser; ComponentLink2Description: http://www.mouser.com/ds/2/115/ds31121-89496.pdf?src-supplier=Mouser; ComponentLink3URL: http://www.diodes.com///datasheets/ds31121.pdf?src-supplier=Avnet; ComponentLink3Description: http://www.diodes.com///datasheets/ds31121.pdf?src-supplier=Avnet; Supplier Part Number 1: DMN32D2LV-7DICT-ND; Case/Package: SOT-563; Weight: 0.000106oz; Polarity: N-CHANNEL; Series: -; ClassName: P109; ClassName: TCPP
R96 = RES SMD 5.1K OHM 1% 1/16W 0402: 5.1 kOhms ±1% 0.063W, 1/16W Chip Resistor 0402 (1005 Metric) Moisture Resistant Thick Film; Manufacturer: Yageo; Manufacturer Part Number: RC0402FR-075K1L; Max Power Dissipation: 63mW; Temperature Coefficient: 100ppm/°C; Voltage Rating (DC): 50V; Supplier 1: Digi-Key; Stock 1: 19803; Pricing 1: 1=0.1, 10=0.016, 100=0.0064, 1000=0.0029, 2500=0.0025, 5000=0.0021 (USD); Case/Package: 0402; Case Code (Metric): 1005; Case Code (Imperial): 0402; Min Operating Temperature: -55°C; Max Operating Temperature: 155°C; Packaging: Tape and Reel; Composition: Thick Film; Number of Terminations: 2; Package Quantity: 1; Power Rating: 63mW; Military Standard: Not; Features: Moisture Resistant; Voltage Rating: 50V; Termination: SMD/SMT; Working Voltage: 50V; Length: 1mm; Height: 0.016inch; Width: 0.02inch; Depth: 0.5mm; Lead Free: Lead Free; REACH SVHC: Unknown; ComponentLink1URL: https://www.verical.com/server-webapp/html/getDatasheet?partID=323636&src-supplier=Verical; ComponentLink1Description: https://www.verical.com/server-webapp/html/getDatasheet?partID=323636&src-supplier=Verical; ComponentLink2URL: http://www.yageo.com/documents/recent/PYu-RC_Group_51_RoHS_L_10.pdf?src-supplier=Digi-Key; ComponentLink2Description: http://www.yageo.com/documents/recent/PYu-RC_Group_51_RoHS_L_10.pdf?src-supplier=Digi-Key; ComponentLink3URL: http://www.farnell.com/datasheets/2167052.pdf?src-supplier=Element14; ComponentLink3Description: http://www.farnell.com/datasheets/2167052.pdf?src-supplier=Element14; ComponentLink4URL: http://www.yageo.com/documents/recent/PYu-RC0402_51_RoHS_L_6_r.pdf?src-supplier=Future+Electronics; ComponentLink4Description: http://www.yageo.com/documents/recent/PYu-RC0402_51_RoHS_L_6_r.pdf?src-supplier=Future+Electronics; ComponentLink5URL: http://www.yageo.com/documents/recent/PYu-RC0402_51_RoHS_L_6_r.pdf?src-supplier=Mouser; ComponentLink5Description: http://www.yageo.com/documents/recent/PYu-RC0402_51_RoHS_L_6_r.pdf?src-supplier=Mouser; ComponentLink6URL: http://www.farnell.com/datasheets/1018594.pdf?src-supplier=Element14; ComponentLink6Description: http://www.farnell.com/datasheets/1018594.pdf?src-supplier=Element14; Supplier Part Number 1: 311-5.10KLRCT-ND; Mount: Surface Mount
R97 R99 R101 = RES SMD 100K OHM 1% 1/16W 0402: as R74 on sheet ESP32_Module; Supplier 1: Digi-Key; Stock 1: 47448883; Pricing 1: 1=0.1, 10=0.016, 100=0.0064, 1000=0.0029, 2500=0.0025, 5000=0.0021 (USD); Case Code (Metric): 1005; Case Code (Imperial): 0402; Min Operating Temperature: -55°C; Max Operating Temperature: 155°C; Composition: Thick Film; Packaging: Tape and Reel; Package Quantity: 1; Number of Terminations: 2; Termination: SMD/SMT; Military Standard: Not; Max Power Dissipation: 63mW; Working Voltage: 50V; Features: Moisture Resistant; Length: 0.039inch; Height: 0.016inch; Width: 0.02inch; Depth: 0.5mm; REACH SVHC: No SVHC; Lead Free: Lead Free; ComponentLink1URL: http://www.yageo.com/documents/recent/PYu-RC_Group_51_RoHS_L_10.pdf?src-supplier=Digi-Key; ComponentLink1Description: http://www.yageo.com/documents/recent/PYu-RC_Group_51_RoHS_L_10.pdf?src-supplier=Digi-Key; ComponentLink2URL: http://www.farnell.com/datasheets/1018594.pdf?src-supplier=Element14; ComponentLink2Description: http://www.farnell.com/datasheets/1018594.pdf?src-supplier=Element14; ComponentLink3URL: http://www.yageo.com/documents/recent/PYu-RC_Group_51_RoHS_L_9.pdf?src-supplier=Verical; ComponentLink3Description: http://www.yageo.com/documents/recent/PYu-RC_Group_51_RoHS_L_9.pdf?src-supplier=Verical; ComponentLink4URL: http://www.yageo.com/documents/recent/PYu-RC_Group_51_RoHS_L_9.pdf?src-supplier=Mouser; ComponentLink4Description: http://www.yageo.com/documents/recent/PYu-RC_Group_51_RoHS_L_9.pdf?src-supplier=Mouser; ComponentLink5URL: http://documents.rs-components.com/techlib://itc_doclist_GB.htm?stockno=6185797&src-supplier=RSComponents; ComponentLink5Description: http://documents.rs-components.com/techlib://itc_doclist_GB.htm?stockno=6185797&src-supplier=RSComponents; Supplier Part Number 1: 311-100KLRDKR-ND; Case/Package: 0402; Mount: Surface Mount
  R99 R101: ClassName: P109
R98 R100 = RES SMD 10K OHM 1% 1/16W 0402: as R80 on sheet BG95_Broadband_Modem; Supplier 1: Digi-Key; Stock 1: 839368; Pricing 1: 1=0.1, 10=0.035, 100=0.014, 1000=0.0063, 2500=0.0055, 5000=0.0045 (USD); Case/Package: 0402; Case Code (Metric): 1005; Case Code (Imperial): 0402; Min Operating Temperature: -55°C; Max Operating Temperature: 155°C; Packaging: Tape and Reel; Composition: Thick Film; Number of Terminations: 2; Features: Moisture Resistant; Length: 0.039inch; Height: 0.016inch; Width: 0.02inch; ComponentLink1URL: http://www.yageo.com/NewPortal/yageodocoutput?fileName=/pdf/R-Chip/PYu-RC_51_RoHS_P_0.pdf&src-supplier=Digi-Key; ComponentLink1Description: http://www.yageo.com/NewPortal/yageodocoutput?fileName=/pdf/R-Chip/PYu-RC_51_RoHS_P_0.pdf&src-supplier=Digi-Key; Supplier Part Number 1: YAG1249CT-ND; ClassName: P109; Mount: Surface Mount